# EAGLE design BusBlasterv4 (EAGLE 5.07)
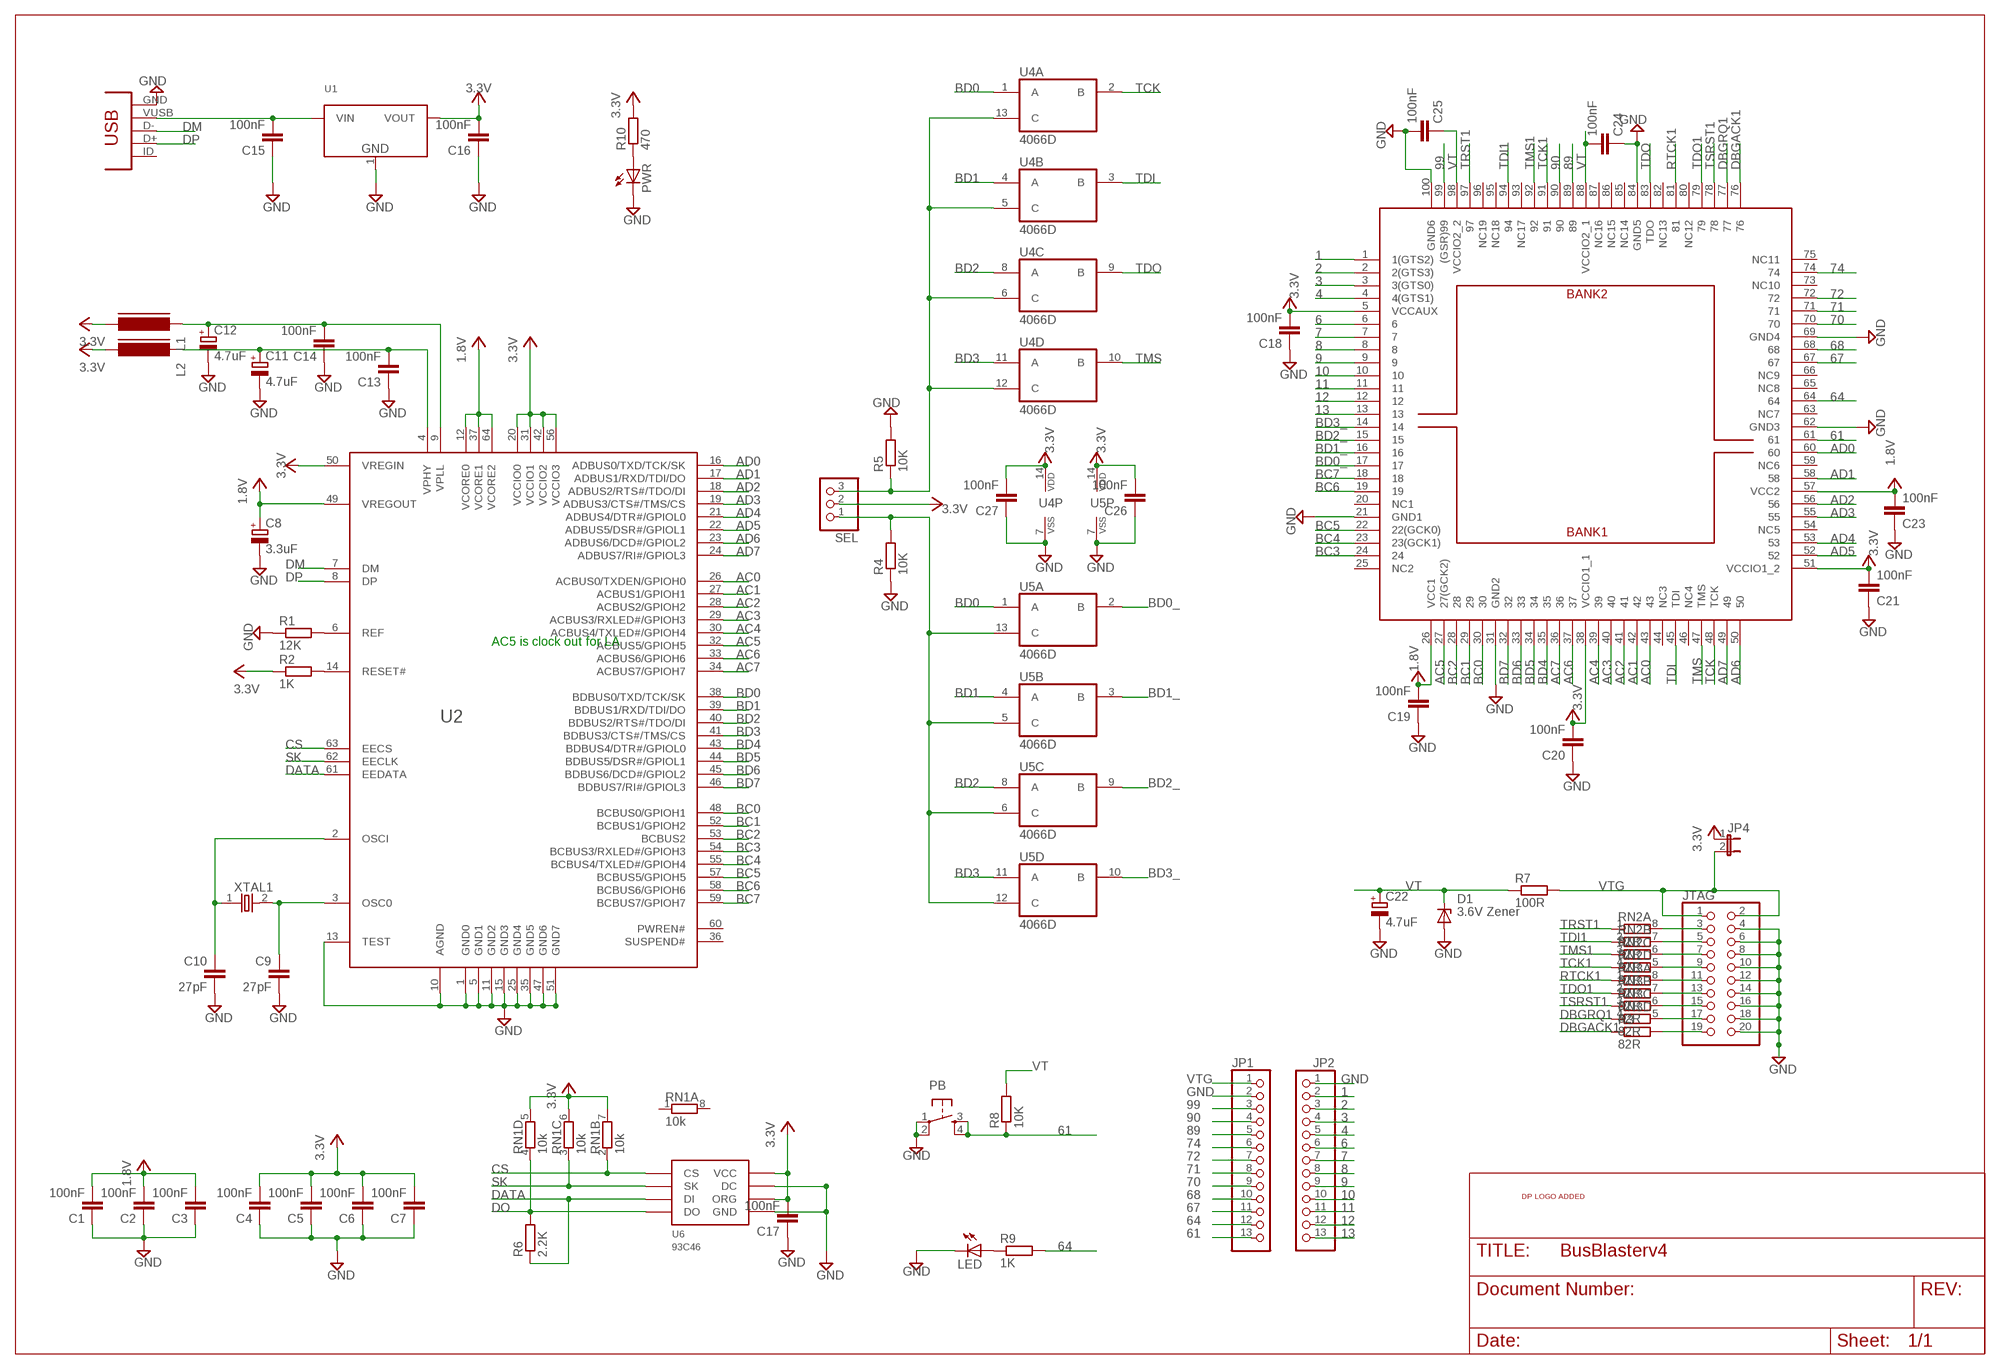
[diagram p0: schematic, sheet 1]

## Parts
C1  100nF  CAPC603  [C603]
C2  100nF  CAPC603  [C603]
C3  100nF  CAPC603  [C603]
C4  100nF  CAPC603  [C603]
C5  100nF  CAPC603  [C603]
C6  100nF  CAPC603  [C603]
C7  100nF  CAPC603  [C603]
C8  3.3uF  CAP_POLSMC_A  [SMC_A]
C9  27pF  CAPC603  [C603]
C10  27pF  CAPC603  [C603]
C11  4.7uF  CAP_POLSMC_A  [SMC_A]
C12  4.7uF  CAP_POLSMC_A  [SMC_A]
C13  100nF  CAPC603  [C603]
C14  100nF  CAPC603  [C603]
C15  100nF  CAPC603  [C603]
C16  100nF  CAPC603  [C603]
C17  100nF  CAPC603  [C603]
C18  100nF  CAPC603  [C603]
C19  100nF  CAPC603  [C603]
C20  100nF  CAPC603  [C603]
C21  100nF  CAPC603  [C603]
C22  4.7uF  CAP_POLSMC_A  [SMC_A]
C23  100nF  CAPC603  [C603]
C24  100nF  CAPC603  [C603]
C25  100nF  CAPC603  [C603]
C26  100nF  CAPC603  [C603]
C27  100nF  CAPC603  [C603]
D1  3.6V Zener  ZENERSOD-123  [SOD-123]
JP1  PINHD-1X13  [1X13]
JP2  PINHD-1X13  [1X13]
JP4  JP1EJP  [1X02]
JTAG  PINHEAD_-_COPY_PINHD-2X10SHROUDED  [PINHEAD_-_COPY_PINSHRD_PTH_2X10]
L1  FERRITE_BEAD603  [FB603]
L2  FERRITE_BEAD603  [FB603]
LED  LED805  [LED-805]
PB  SW-SMD-SMALL  [TACT_SWITCH_SMALL]
PWR  LEDCHIPLED_0805  [CHIPLED_0805]
R1  12K  RESISTORR603  [R603]
R2  1K  RESISTORR603  [R603]
R3  82R  RESISTORR603  [R603]
R4  10K  RESISTORR603  [R603]
R5  10K  RESISTORR603  [R603]
R6  2.2K  RESISTORR603  [R603]
R7  100R  RESISTORR1206  [R1206]
R8  10K  RESISTORR603  [R603]
R9  1K  RESISTORR603  [R603]
R10  470  RESISTORR603  [R603]
RN1  10k  RNETWORK  [RN8P-4R-CRA06S]
RN2  82R  RNETWORK  [RN8P-4R-CRA06S]
RN3  82R  RNETWORK  [RN8P-4R-CRA06S]
SEL  PINHD-1X3  [1X03]
U1  LD1117-3.3SOT223  [SOT223]
U2  FT2232H  [LQFP64]
U3  XC2C64A  [VQ100]
U4  4066D  [SO14]
U5  4066D  [SO14]
U6  93C46  [SOIC8]
U$1  DP_LOGO1.5X1.5  [DP_LOGO_ART_1.5X1.5]
USB  CON-USB-MINI-BUSB1  [CONN_USB_MINI-B]
XTAL1  OSC-XTAL  [HC-49U]

## Nets
1: JP2.2 U3.1(1(GTS2))
1.8V: C1.2 C2.2 C3.2 C8.+ C19.2 C23.2 U2.12(VCORE0) U2.37(VCORE1) U2.49(VREGOUT) U2.64(VCORE2) U3.26(VCC1) U3.57(VCC2)
2: JP2.3 U3.2(2(GTS3))
3: JP2.4 U3.3(3(GTS0))
4: JP2.5 U3.4(4(GTS1))
6: JP2.6 U3.6
7: JP2.7 U3.7
8: JP2.8 U3.8
9: JP2.9 U3.9
10: JP2.10 U3.10
11: JP2.11 U3.11
12: JP2.12 U3.12
13: JP2.13 U3.13
61: JP1.13 PB.3 PB.4 R8.1 U3.61
64: JP1.12 R9.2 U3.64
67: JP1.11 U3.67
68: JP1.10 U3.68
70: JP1.9 U3.70
71: JP1.8 U3.71
72: JP1.7 U3.72
74: JP1.6 U3.74
89: JP1.5 U3.89
90: JP1.4 U3.90
99: JP1.3 U3.99((GSR)99)
+3V3: C4.2 C5.2 C6.2 C7.2 C16.2 C17.2 C18.2 C20.2 C21.2 C26.2 C27.2 JP4.1 L1.2 L2.2 R2.1 R10.2 RN1.5 RN1.6 RN1.7 SEL.2 U1.2(VOUT) U2.20(VCCIO0) U2.31(VCCIO1) U2.42(VCCIO2) U2.50(VREGIN) U2.56(VCCIO3) U3.5(VCCAUX) U3.38(VCCIO1_1) U3.51(VCCIO1_2) U4.14(P:VDD) U5.14(P:VDD) U6.6(ORG) U6.8(VCC) ; supply symbol labelled 3.3V
AC0: U2.26(ACBUS0/TXDEN/GPIOH0) U3.43
AC1: U2.27(ACBUS1/GPIOH1) U3.42
AC2: U2.28(ACBUS2/GPIOH2) U3.41
AC3: U2.29(ACBUS3/RXLED#/GPIOH3) U3.40
AC4: U2.30(ACBUS4/TXLED#/GPIOH4) U3.39
AC5: U2.32(ACBUS5/GPIOH5) U3.27(27(GCK2))
AC6: U2.33(ACBUS6/GPIOH6) U3.37
AC7: U2.34(ACBUS7/GPIOH7) U3.36
AD0: U2.16(ADBUS0/TXD/TCK/SK) U3.60
AD1: U2.17(ADBUS1/RXD/TDI/DO) U3.58
AD2: U2.18(ADBUS2/RTS#/TDO/DI) U3.56
AD3: U2.19(ADBUS3/CTS#/TMS/CS) U3.55
AD4: U2.21(ADBUS4/DTR#/GPIOL0) U3.53
AD5: U2.22(ADBUS5/DSR#/GPIOL1) U3.52
AD6: U2.23(ADBUS6/DCD#/GPIOL2) U3.50
AD7: U2.24(ADBUS7/RI#/GPIOL3) U3.49
BC0: U2.48(BCBUS0/GPIOH1) U3.30
BC1: U2.52(BCBUS1/GPIOH2) U3.29
BC2: U2.53(BCBUS2) U3.28
BC3: U2.54(BCBUS3/RXLED#/GPIOH3) U3.24
BC4: U2.55(BCBUS4/TXLED#/GPIOH4) U3.23(23(GCK1))
BC5: U2.57(BCBUS5/GPIOH5) U3.22(22(GCK0))
BC6: U2.58(BCBUS6/GPIOH6) U3.19
BC7: U2.59(BCBUS7/GPIOH7) U3.18
BD0: U2.38(BDBUS0/TXD/TCK/SK) U4.1(A:A) U5.1(A:A)
BD0_: U3.17 U5.2(A:B)
BD1: U2.39(BDBUS1/RXD/TDI/DO) U4.4(B:A) U5.4(B:A)
BD1_: U3.16 U5.3(B:B)
BD2: U2.40(BDBUS2/RTS#/TDO/DI) U4.8(C:A) U5.8(C:A)
BD2_: U3.15 U5.9(C:B)
BD3: U2.41(BDBUS3/CTS#/TMS/CS) U4.11(D:A) U5.11(D:A)
BD3_: U3.14 U5.10(D:B)
BD4: U2.43(BDBUS4/DTR#/GPIOL0) U3.35
BD5: U2.44(BDBUS5/DSR#/GPIOL1) U3.34
BD6: U2.45(BDBUS6/DCD#/GPIOL2) U3.33
BD7: U2.46(BDBUS7/RI#/GPIOL3) U3.32
CS: RN1.2 U2.63(EECS) U6.1(CS)
DATA: R6.1 U2.61(EEDATA) U6.3(DI)
DBGACK1: R3.1 U3.76
DBGRQ1: RN3.4 U3.77
DM: U2.7(DM) USB.D-
DO: R6.2 RN1.4 U6.4(DO)
DP: U2.8(DP) USB.D+
GND: C1.1 C2.1 C3.1 C4.1 C5.1 C6.1 C7.1 C8.- C9.2 C10.2 C11.- C12.- C13.1 C14.1 C15.1 C16.1 C17.1 C18.1 C19.1 C20.1 C21.1 C22.- C23.1 C24.1 C25.2 C26.1 C27.1 D1.A JP1.2 JP2.1 JTAG.4 JTAG.6 JTAG.8 JTAG.10 JTAG.12 JTAG.14 JTAG.16 JTAG.18 JTAG.20 LED.C PB.1 PB.2 PWR.C R1.1 R4.1 R5.2 U1.1(GND) U2.1(GND0) U2.5(GND1) U2.10(AGND) U2.11(GND2) U2.13(TEST) U2.15(GND3) U2.25(GND4) U2.35(GND5) U2.47(GND6) U2.51(GND7) U3.21(GND1) U3.31(GND2) U3.62(GND3) U3.69(GND4) U3.84(GND5) U3.100(GND6) U4.7(P:VSS) U5.7(P:VSS) U6.5(GND) U6.7(DC) USB.GND
N$1: C9.1 U2.3(OSC0) XTAL1.2
N$2: C10.1 U2.2(OSCI) XTAL1.1
N$3: R2.2 U2.14(RESET#)
N$4: R1.2 U2.6(REF)
N$5: C15.2 U1.3(VIN) USB.VUSB
N$6: PWR.A R10.1
N$8: LED.A R9.1
N$12: JTAG.3 RN2.8
N$27: JTAG.5 RN2.7
N$28: JTAG.7 RN2.6
N$32: JTAG.9 RN2.5
N$33: JTAG.11 RN3.8
N$38: JTAG.13 RN3.7
N$45: JTAG.15 RN3.6
N$52: JTAG.17 RN3.5
N$64: JTAG.19 R3.2
N$72: R5.1 SEL.3 U4.5(B:C) U4.6(C:C) U4.12(D:C) U4.13(A:C)
N$73: R4.2 SEL.1 U5.5(B:C) U5.6(C:C) U5.12(D:C) U5.13(A:C)
RTCK1: RN3.1 U3.81
SK: RN1.3 U2.62(EECLK) U6.2(SK)
TCK: U3.48(TCK) U4.2(A:B)
TCK1: RN2.4 U3.91
TDI: U3.45(TDI) U4.3(B:B)
TDI1: RN2.2 U3.94
TDO: U3.83(TDO) U4.9(C:B)
TDO1: RN3.2 U3.79
TMS: U3.47(TMS) U4.10(D:B)
TMS1: RN2.3 U3.92
TRST1: RN2.1 U3.97
TSRST1: RN3.3 U3.78
VPHY: C11.+ C13.2 L2.1 U2.4(VPHY)
VPLL: C12.+ C14.2 L1.1 U2.9(VPLL)
VT: C22.+ C24.2 C25.1 D1.C R7.1 R8.2 U3.88(VCCIO2_1) U3.98(VCCIO2_2)
VTG: JP1.1 JP4.2 JTAG.1 JTAG.2 R7.2
Unconnected: RN1.1 RN1.8 U2.36(SUSPEND#) U2.60(PWREN#) U3.20(NC1) U3.25(NC2) U3.44(NC3) U3.46(NC4) U3.54(NC5) U3.59(NC6) U3.63(NC7) U3.65(NC8) U3.66(NC9) U3.73(NC10) U3.75(NC11) U3.80(NC12) U3.82(NC13) U3.85(NC14) U3.86(NC15) U3.87(NC16) U3.93(NC17) U3.95(NC18) U3.96(NC19) USB.BODY@1(BODY) USB.BODY@2(BODY) USB.BODY@3(BODY) USB.BODY@4(BODY) USB.ID(USBID)

## Notes on the sheet
- AC5 is clock out for LA

## Library data of the parts
C1-C7 C9 C10 C13-C21 C23-C27 = dp_devices:CAP
C8 C11 C12 C22 = DP-EagleLibrary:CAP_POL
D1 = dp_devices:ZENER: Zener Diode SOD-323
JP1 JP2 = pinhead:PINHD-1X13: PIN HEADER
JP4 = jumper:JP1E: JUMPER
JTAG = LPC1768board:PINHEAD_-_COPY_PINHD-2X10: PIN HEADER
L1 L2 = dp_devices:FERRITE_BEAD
LED = dp_devices:LED
PB = dp_devices:SW-SMD-SMALL
PWR = led:LED: LED OSRAM: - CHIPLED LG R971, LG N971, LY N971, LG Q971, LY Q971, LO R971, LY R971 LH N974, LH R974 LS Q976, LO Q976, LY Q976 LO Q996 - Hyper CHIPLED LW Q18S LB Q993, LB Q99A, LB R99A - SideLED LS A670, LO A670, LY A670, LG A670, LP A670 LB A673, LV A673, LT A673, LW A673 LH A674 LY A675 LS A676, LA A676, LO A676, LY A676, LW A676 LS A679, LY A679, LG A679 - Hyper Micro SIDELED® LS Y876, LA Y876, LO Y876, LY Y876 LT Y87S - SmartLED LW L88C, LW L88S LB L89C, LB L89S, LG L890 LS L89K, LO L89K, LY L89K LS L896, LA L896, LO L896, LY L896 - TOPLED LS T670, LO T670, LY T670, LG T670, LP T670 LSG T670, LSP T670, LSY T670, LOP T670, LYG T670 LG T671, LOG T671, LSG T671 LB T673, LV T673, LT T673, LW T673 LH T674 LS T676, LA T676, LO T676, LY T676, LB T676, LH T676, LSB T676, LW T676 LB T67C, LV T67C, LT T67C, LS T67K, LO T67K, LY T67K, LW E67C LS E67B, LA E67B, LO E67B, LY E67B, LB E67C, LV E67C, LT E67C LW T67C LS T679, LY T679, LG T679 LS T770, LO T770, LY T770, LG T770, LP T770 LB T773, LV T773, LT T773, LW T773 LH T774 LS E675, LA E675, LY E675, LS T675 LS T776, LA T776, LO T776, LY T776, LB T776 LHGB T686 LT T68C, LB T68C - Hyper Mini TOPLED® LB M676 - Mini TOPLED Santana® LG M470 LS M47K, LO M47K, LY M47K Source: http://www.osram.convergy.de LUXEON: - LUMILED® LXK2-PW12-R00, LXK2-PW12-S00, LXK2-PW14-U00, LXK2-PW14-V00 LXK2-PM12-R00, LXK2-PM12-S00, LXK2-PM14-U00 LXK2-PE12-Q00, LXK2-PE12-R00, LXK2-PE12-S00, LXK2-PE14-T00, LXK2-PE14-U00 LXK2-PB12-K00, LXK2-PB12-L00, LXK2-PB12-M00, LXK2-PB14-N00, LXK2-PB14-P00, LXK2-PB14-Q00 LXK2-PR12-L00, LXK2-PR12-M00, LXK2-PR14-Q00, LXK2-PR14-R00 LXK2-PD12-Q00, LXK2-PD12-R00, LXK2-PD12-S00 LXK2-PH12-R00, LXK2-PH12-S00 LXK2-PL12-P00, LXK2-PL12-Q00, LXK2-PL12-R00 Source: www.luxeon.com KINGBRIGHT: KA-3528ASYC Source: www.kingbright.com
R1-R10 = dp_devices:RESISTOR
RN1-RN3 = dp_devices:RNETWORK: 4 Resistor Array 0603
SEL = pinhead:PINHD-1X3: PIN HEADER
U1 = dp_devices:LD1117-3.3
U2 = dp_devices:FT2232H: DUAL HIGH SPEED USB TO MULTIPURPOSE UART/FIFO IC
U3 = fpga:XC2C64A
U4 U5 = 40xx:4066: Quad bilateral ANALOG SWITCH
U6 = DP-EagleLibrary:93C46
U$1 = dp_devices:DP_LOGO
USB = dp_devices:CON-USB-MINI-B: USB connector
XTAL1 = dp_devices:OSC-XTAL

## Board
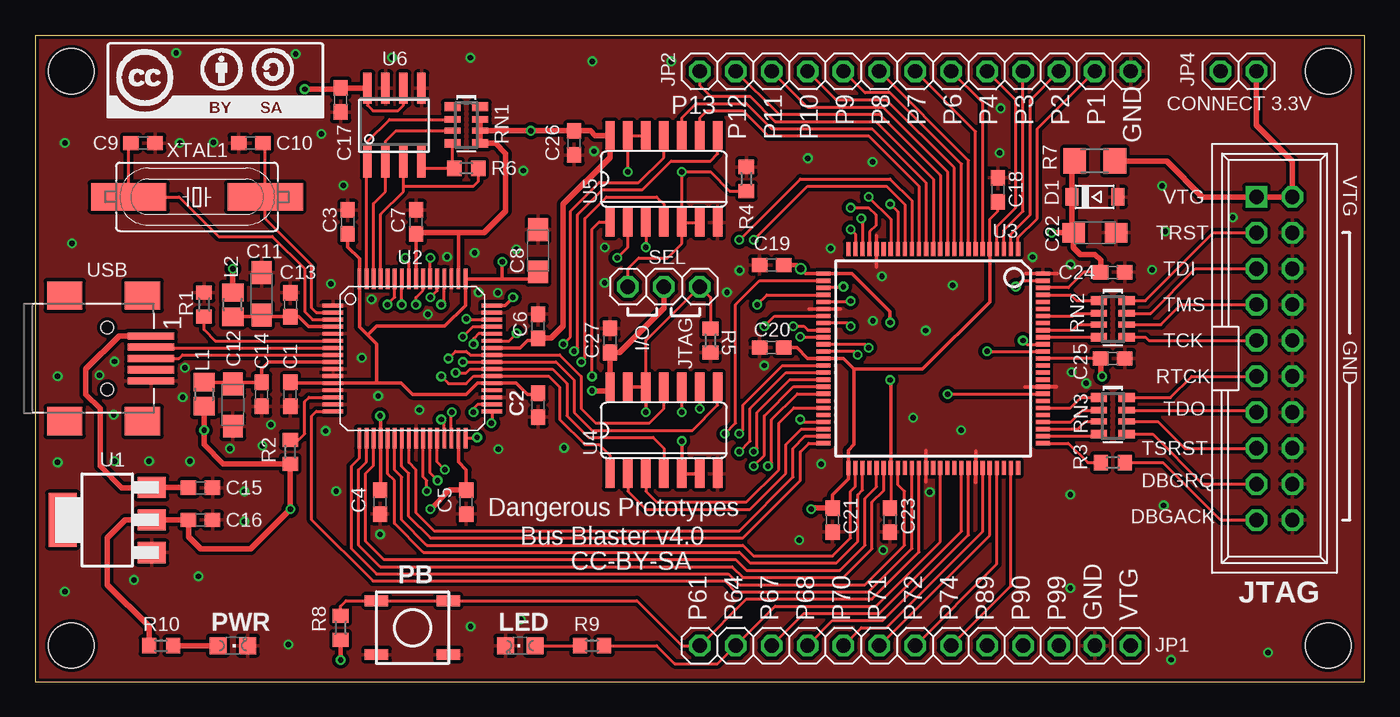
[diagram p1: board, top side]
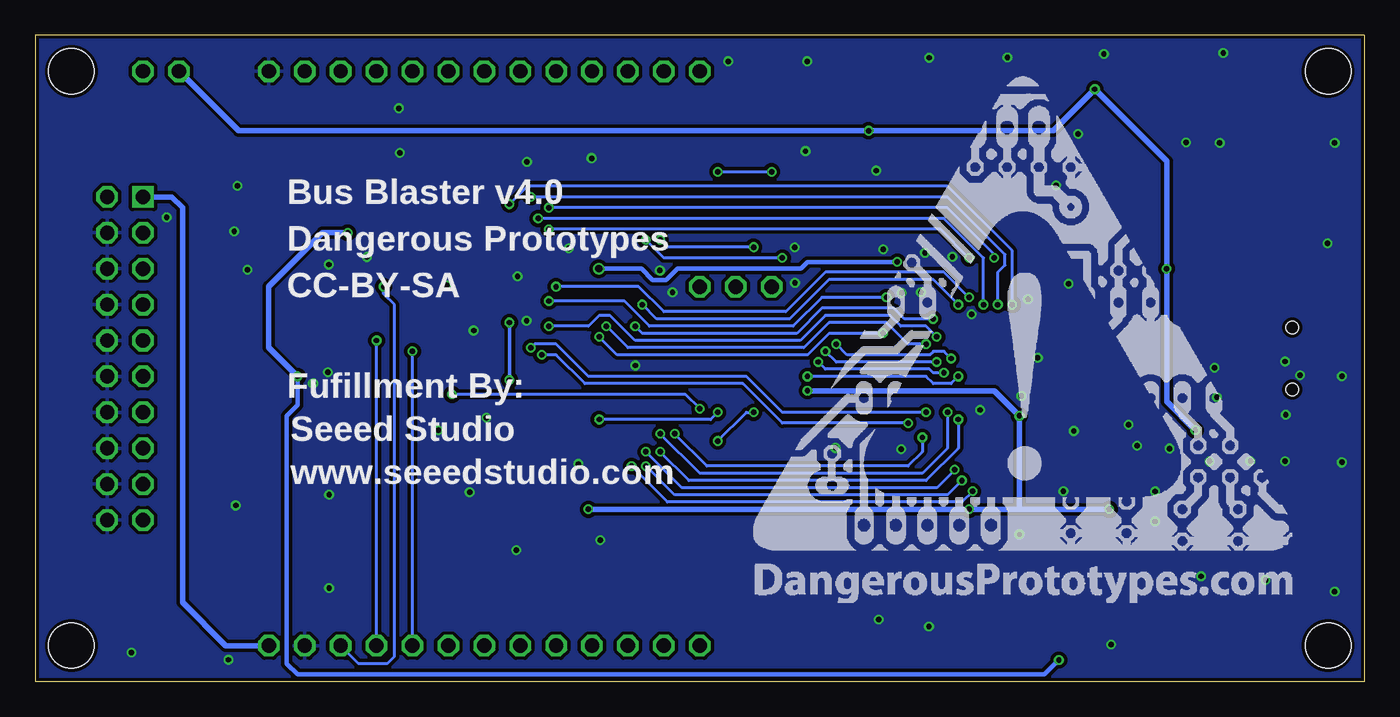
[diagram p2: board, bottom side, seen from below]

Size 93.98 x 45.72 mm. Coordinates in mm from the lower left corner, seen from the top.
Outline: 0,0 93.98,0 93.98,45.72 0,45.72 0,0
Copper layers (1*16): Top 0.035mm / dielectric 1.5mm / Bottom 0.035mm
Design rules "Fusion_eagle_rule_v1.1": minimum track width 6mil, minimum drill 12mil, track to track 6mil, track to pad 6mil, pad to pad 6mil, via to via 6mil, smd to smd 0mil, copper to edge 10mil, drill to drill 10mil, minimum pad ring 10mil, minimum via ring 6mil, stop-mask expansion 2mil, vias tented up to drill 100mil, thermal gap 10mil
Holes 3.2 mm at 2.54,2.54 91.44,2.54 2.54,43.18 91.44,43.18

### Footprints (pad centres in the part's own frame; a part is rotated, then mirrored left to right if it is on the bottom)
C603 = smd 1.1 x 1: 1 -0.85,0; 2 0.85,0
SMC_A = smd 1.6 x 1.4: + -1.5,0; - 1.5,0
SOD-123 = smd 0.91 x 1.22: A 1.635,0; C -1.635,0
1X13 = drill 1.016 octagon: 1 -15.24,0; 2 -12.7,0; 3 -10.16,0; 4 -7.62,0; 5 -5.08,0; 6 -2.54,0; 7 0,0; 8 2.54,0; 9 5.08,0; 10 7.62,0; 11 10.16,0; 12 12.7,0; 13 15.24,0
1X02 = drill 1.016 octagon: 1 -1.27,0; 2 1.27,0
PINHEAD_-_COPY_PINSHRD_PTH_2X10 = drill 1.016 square: 1 -11.43,-1.27 | drill 1.016 octagon: 2 -11.43,1.27; 3 -8.89,-1.27; 4 -8.89,1.27; 5 -6.35,-1.27; 6 -6.35,1.27; 7 -3.81,-1.27; 8 -3.81,1.27; 9 -1.27,-1.27; 10 -1.27,1.27; 11 1.27,-1.27; 12 1.27,1.27; 13 3.81,-1.27; 14 3.81,1.27; 15 6.35,-1.27; 16 6.35,1.27; 17 8.89,-1.27; 18 8.89,1.27; 19 11.43,-1.27; 20 11.43,1.27
FB603 = smd 1.3 x 1.5: 1 -0.85,0; 2 0.85,0
LED-805 = smd 1.2 x 1.2: A 0,-1.05; C 0,1.05
TACT_SWITCH_SMALL = smd 1.651 x 0.762: 1 -2.54,1.905; 2 2.54,1.905; 3 -2.54,-1.905; 4 2.54,-1.905
CHIPLED_0805 = smd 1.2 x 1.2: A 0,-1.05; C 0,1.05
R603 = smd 1 x 1.1: 1 -0.85,0; 2 0.85,0
R1206 = smd 1.6 x 1.803: 1 -1.422,0; 2 1.422,0
RN8P-4R-CRA06S = smd 0.63 x 1.15: 1 -1.295,-0.975; 4 1.295,-0.975; 5 1.295,0.975; 8 -1.295,0.975 | smd 0.44 x 1.15: 2 -0.4,-0.975; 3 0.4,-0.975; 6 0.4,0.975; 7 -0.4,0.975
1X03 = drill 1.016 octagon: 1 -2.54,0; 2 0,0; 3 2.54,0
SOT223 = smd 1.5 x 2: 1 -2.3,-3.15; 2 0,-3.15; 3 2.3,-3.15 | smd 3.8 x 2: 4 0,3.15
LQFP64 = smd 1.45 x 0.27: 1 -5.625,3.75; 2 -5.625,3.25; 3 -5.625,2.75; 4 -5.625,2.25; 5 -5.625,1.75; 6 -5.625,1.25; 7 -5.625,0.75; 8 -5.625,0.25; 9 -5.625,-0.25; 10 -5.625,-0.75; 11 -5.625,-1.25; 12 -5.625,-1.75; 13 -5.625,-2.25; 14 -5.625,-2.75; 15 -5.625,-3.25; 16 -5.625,-3.75; 33 5.625,-3.75; 34 5.625,-3.25; 35 5.625,-2.75; 36 5.625,-2.25; 37 5.625,-1.75; 38 5.625,-1.25; 39 5.625,-0.75; 40 5.625,-0.25; 41 5.625,0.25; 42 5.625,0.75; 43 5.625,1.25; 44 5.625,1.75; 45 5.625,2.25; 46 5.625,2.75; 47 5.625,3.25; 48 5.625,3.75 | smd 0.27 x 1.45: 17 -3.75,-5.625; 18 -3.25,-5.625; 19 -2.75,-5.625; 20 -2.25,-5.625; 21 -1.75,-5.625; 22 -1.25,-5.625; 23 -0.75,-5.625; 24 -0.25,-5.625; 25 0.25,-5.625; 26 0.75,-5.625; 27 1.25,-5.625; 28 1.75,-5.625; 29 2.25,-5.625; 30 2.75,-5.625; 31 3.25,-5.625; 32 3.75,-5.625; 49 3.75,5.625; 50 3.25,5.625; 51 2.75,5.625; 52 2.25,5.625; 53 1.75,5.625; 54 1.25,5.625; 55 0.75,5.625; 56 0.25,5.625; 57 -0.25,5.625; 58 -0.75,5.625; 59 -1.25,5.625; 60 -1.75,5.625; 61 -2.25,5.625; 62 -2.75,5.625; 63 -3.25,5.625; 64 -3.75,5.625
VQ100 = smd 1 x 0.3: 1 -7.75,6; 2 -7.75,5.5; 3 -7.75,5; 4 -7.75,4.5; 5 -7.75,4; 6 -7.75,3.5; 7 -7.75,3; 8 -7.75,2.5; 9 -7.75,2; 10 -7.75,1.5; 11 -7.75,1; 12 -7.75,0.5; 13 -7.75,0; 14 -7.75,-0.5; 15 -7.75,-1; 16 -7.75,-1.5; 17 -7.75,-2; 18 -7.75,-2.5; 19 -7.75,-3; 20 -7.75,-3.5; 21 -7.75,-4; 22 -7.75,-4.5; 23 -7.75,-5; 24 -7.75,-5.5; 25 -7.75,-6; 51 7.75,-6; 52 7.75,-5.5; 53 7.75,-5; 54 7.75,-4.5; 55 7.75,-4; 56 7.75,-3.5; 57 7.75,-3; 58 7.75,-2.5; 59 7.75,-2; 60 7.75,-1.5; 61 7.75,-1; 62 7.75,-0.5; 63 7.75,0; 64 7.75,0.5; 65 7.75,1; 66 7.75,1.5; 67 7.75,2; 68 7.75,2.5; 69 7.75,3; 70 7.75,3.5; 71 7.75,4; 72 7.75,4.5; 73 7.75,5; 74 7.75,5.5; 75 7.75,6 | smd 0.3 x 1: 26 -6,-7.75; 27 -5.5,-7.75; 28 -5,-7.75; 29 -4.5,-7.75; 30 -4,-7.75; 31 -3.5,-7.75; 32 -3,-7.75; 33 -2.5,-7.75; 34 -2,-7.75; 35 -1.5,-7.75; 36 -1,-7.75; 37 -0.5,-7.75; 38 0,-7.75; 39 0.5,-7.75; 40 1,-7.75; 41 1.5,-7.75; 42 2,-7.75; 43 2.5,-7.75; 44 3,-7.75; 45 3.5,-7.75; 46 4,-7.75; 47 4.5,-7.75; 48 5,-7.75; 49 5.5,-7.75; 50 6,-7.75; 76 6,7.75; 77 5.5,7.75; 78 5,7.75; 79 4.5,7.75; 80 4,7.75; 81 3.5,7.75; 82 3,7.75; 83 2.5,7.75; 84 2,7.75; 85 1.5,7.75; 86 1,7.75; 87 0.5,7.75; 88 0,7.75; 89 -0.5,7.75; 90 -1,7.75; 91 -1.5,7.75; 92 -2,7.75; 93 -2.5,7.75; 94 -3,7.75; 95 -3.5,7.75; 96 -4,7.75; 97 -4.5,7.75; 98 -5,7.75; 99 -5.5,7.75; 100 -6,7.75
SO14 = smd 0.66 x 2.032: 1 -3.81,-3.073; 2 -2.54,-3.073; 3 -1.27,-3.073; 4 0,-3.073; 5 1.27,-3.073; 6 2.54,-3.073; 7 3.81,-3.073; 8 3.81,3.073; 9 2.54,3.073; 10 1.27,3.073; 11 0,3.073; 12 -1.27,3.073; 13 -2.54,3.073; 14 -3.81,3.073
SOIC8 = smd 0.6 x 2.2: 1 -1.905,-2.6; 2 -0.635,-2.6; 3 0.635,-2.6; 4 1.905,-2.6; 5 1.905,2.6; 6 0.635,2.6; 7 -0.635,2.6; 8 -1.905,2.6
CONN_USB_MINI-B = smd 2 x 2.5: BODY@1 -4.45,2.5; BODY@2 4.45,2.5; BODY@3 4.45,-3; BODY@4 -4.45,-3 | smd 0.5 x 3.3: D+ 0,3.1; D- -0.8,3.1; GND 1.6,3.1; ID 0.8,3.1; VUSB -1.6,3.1 | hole 0.9: -2.2,0; 2.2,0
HC-49U = smd 5.334 x 1.93: 1 -4.826,0; 2 4.826,0

### Placement (x,y rotation side)
C1  18.03,20.32 90 top
C2  35.56,19.56 90 top
C3  22.1,32.51 270 top
C4  24.38,12.7 90 top
C5  30.48,12.7 90 top
C6  35.56,25.15 270 top
C7  26.92,32.51 270 top
C8  35.56,30.48 90 top
C9  7.62,38.1 0 top
C10  15.24,38.1 180 top
C11  16,27.43 90 top
C12  13.97,19.56 270 top
C13  18.03,26.67 270 top
C14  16,20.32 90 top
C15  11.68,13.72 180 top
C16  11.68,11.43 180 top
C17  21.59,41.15 90 top
C18  68.07,34.8 270 top
C19  52.07,29.46 0 top
C20  52.07,23.62 0 top
C21  56.39,11.43 90 top
C22  74.93,31.75 0 top
C23  60.45,11.43 90 top
C24  76.2,28.96 180 top
C25  76.2,22.86 0 top
C26  38.1,38.1 90 top
C27  40.64,24.13 270 top
D1  74.93,34.29 0 top
JP1  62.23,2.54 180 top
JP2  62.23,43.18 180 top
JP4  85.09,43.18 0 top
JTAG  87.63,22.86 270 top
L1  11.94,20.32 270 top
L2  13.97,26.67 90 top
LED  34.29,2.54 90 top
PB  26.67,3.81 180 top
PWR  13.97,2.54 270 top
R1  11.94,26.67 270 top
R2  18.03,16.26 90 top
R3  76.2,15.49 0 top
R4  50.29,35.56 270 top
R5  47.75,24.13 270 top
R6  30.48,36.32 180 top
R7  74.93,36.83 0 top
R8  21.59,3.81 270 top
R9  39.37,2.54 0 top
R10  8.89,2.54 180 top
RN1  30.48,39.37 270 top
RN2  76.2,25.65 270 top
RN3  76.2,18.8 270 top
SEL  44.45,27.94 0 top
U1  5.08,11.43 90 top
U2  26.67,22.86 0 top
U3  63.5,22.86 270 top
U4  44.45,17.78 0 top
U5  44.45,35.56 0 top
U6  25.4,39.37 0 top
U$1  43.18,5.59 0 bottom
U$2  [CC-BY-SA]  5.08,39.88 0 top
USB  5.08,22.86 270 top
XTAL1  11.43,34.29 180 top

### Tracks (layer width: path | path; a pad name or v marks a point on that pad's centre or on a via)
1
  Top 0.203: U3.1 69.5,31.4 70.87,32.77 70.87,39.12 JP2.2
1.8V  (via drill 0.38, 0.51)
  Top 0.203: U3.57 60.5,12.49 C23.2
  Top 0.254: C1.2 18.09,21.11 U2.12 24.13,21.11 | 33.02,28.48 U2.49 30.42,26.61 28.96,25.15 24.13,25.15 23.5,24.51 | 33.02,28.48 35.06,28.48 C8.+ | C3.2 22.1,30.73 22.92,29.91 U2.64 22.92,25.09 23.5,24.51 | C2.2 35.39,20.32 34.8,20.32 34.01,21.11 U2.37 31.27,21.11 30.48,20.32 26.67,20.32 25.88,21.11 24.13,21.11 | 23.5,24.51 24.13,23.88 24.13,21.11 | U3.57 60.5,21.29 v60.45,21.34 | v60.45,25.4 60.45,26.16 57.75,28.86 U3.26 54.48,28.86 v54.13,29.21 | 33.02,28.48 v33.02,29.69
  Top 0.305: C19.2 53.88,29.46 v54.13,29.21
  Bottom 0.254: v60.45,25.4 v60.45,21.34
  Bottom 0.305: v54.13,29.21 51.12,29.21 50.32,28.42 49.37,28.42 48.58,29.21 39.85,29.21 39.37,29.69 v33.02,29.69
2
  Top 0.203: U3.2 69,31.66 70.36,33.02 70.36,41.15 JP2.3
3
  Top 0.203: U3.3 68.5,31.92 69.85,33.27 JP2.4
4
  Top 0.203: U3.4 68,32.19 69.34,33.53 69.34,41.15 JP2.5
6
  Top 0.203: U3.6 67,40.95 JP2.6
7
  Top 0.203: U3.7 66.5,38.91 JP2.7
8
  Top 0.203: U3.8 66,36.87 JP2.8
9
  Top 0.203: U3.9 65.5,36.61 60.45,41.66 58.67,41.66 JP2.9
10
  Top 0.203: U3.10 65,36.35 60.2,41.15 56.64,41.15 JP2.10
11
  Top 0.203: JP2.11 54.61,40.64 59.94,40.64 64.5,36.08 U3.11
12
  Top 0.203: JP2.12 52.58,40.13 59.69,40.13 64,35.82 U3.12
13
  Top 0.203: JP2.13 46.99,42.16 47.75,41.4 50.55,41.4 52.32,39.62 59.44,39.62 63.5,35.56 U3.13
61
  Top 0.203: R8.1 21.59,5.33 21.97,5.71 PB.4 PB.3 42.55,5.71 45.72,2.54 JP1.13 50.29,5.84 59.18,5.84 62.5,9.16 U3.61
64
  Top 0.203: U3.64 64,9.9 59.44,5.33 52.32,5.33 JP1.12 48.26,1.27 45.21,1.27 43.94,2.54 R9.2
67
  Top 0.203: U3.67 65.5,10.64 59.69,4.83 54.36,4.83 JP1.11
68
  Top 0.203: U3.68 66,10.37 59.94,4.32 56.39,4.32 JP1.10
70
  Top 0.203: U3.70 67,10.61 60.2,3.81 58.42,3.81 JP1.9
71
  Top 0.203: U3.71 67.5,10.35 JP1.8
72
  Top 0.203: U3.72 68,8.31 JP1.7
74
  Top 0.203: U3.74 69,6.77 JP1.6
89  (via drill 0.38)
  Top 0.203: v67.31,23.37 v67.32,23.36 U3.89
  Bottom 0.203: JP1.5 v67.31,23.37
90  (via drill 0.38)
  Top 0.203: U3.90 70.12,23.86 v69.85,24.13
  Bottom 0.203: JP1.4 v69.85,24.13
99  (via drill 0.38)
  Top 0.203: v69.34,27.94 69.76,28.36 U3.99
  Bottom 0.203: JP1.3 71.12,1.27 69.09,1.27 68.58,1.78 68.58,26.67 69.34,27.43 v69.34,27.94
+3V3  (via drill 0.38)
  Top 0.203: U6.6 26.04,40.77 25.65,40.39 23.88,40.39 23.5,40.77 U6.8 | U3.5 67.5,32.7 68.07,33.27 C18.2
  Top 0.254: U2.42 34.28,23.61 34.8,24.13 35.39,24.13 C6.2 | U2.56 26.92,31.58 C7.2 | C20.2 53.85,23.62 54.61,22.86 U3.38 57.15,22.86 57.91,22.1 | v24.38,18.8 24.42,18.76 U2.20 24.42,13.59 C4.2 | U2.31 29.92,15.55 30.48,14.99 C5.2 | U2.50 29.92,31.7 29.97,31.75 | 57.91,22.1 62.74,22.1 67.5,26.86 U3.5 | 57.91,22.1 57.91,16.76 57.5,16.35 U3.51 57.5,14.32 56.39,13.21 C21.2
  Top 0.381: R10.2 8.04,3.9 5.08,6.86 5.08,10.16 6.35,11.43 U1.2 C16.2 10.83,10.25 11.68,9.4 15.24,9.4 v18.03,12.19 R2.1 13.3,15.41 11.94,16.76 v11.94,17.78 L1.2 | RN1.6 RN1.7 | RN1.6 RN1.5 32.54,38.08 33.27,37.34 33.27,33.27 31.75,31.75 29.97,31.75 27.01,31.75 C7.2 | 38.08,38.97 v35.05,38.97 RN1.6 | 38.08,38.97 C26.2 | SEL.2 44.45,26.42 41.31,23.28 C27.2 U4.14 40.64,20.57 v39.37,20.57 | v13.97,29.21 L2.2 | C5.2 29.3,13.55 v27.94,12.19 | C6.2 36.49,24.3 37.34,25.15 37.34,33.78 40.64,37.08 U5.14 39.6,38.63 39.26,38.97 38.08,38.97 | U6.8 23.47,42 C17.2 21.5,41.91 v19.05,41.91 | C21.2 54.95,12.28 v54.86,12.19
  Bottom 0.381: v11.94,17.78 13.97,19.81 v13.97,29.21 13.97,36.83 v19.05,41.91 21.99,38.97 v35.05,38.97 79.61,38.97 JP4.1 | v18.03,12.19 24.38,12.19 | 24.38,12.19 v27.94,12.19 v54.86,12.19 | 24.38,12.19 v24.38,18.8 26.16,20.57 v39.37,20.57
AC0  (via drill 0.38)
  Top 0.203: U3.43 53.89,20.36 52.07,18.54 52.07,15.49 v51.82,15.24 | v27.69,13.46 27.69,14.22 27.42,14.49 U2.26
  Bottom 0.203: v51.82,15.24 49.28,12.7 28.45,12.7 v27.69,13.46
AC1  (via drill 0.38)
  Top 0.203: U3.42 53.63,20.86 51.56,18.8 51.56,16 v50.8,15.24 | U2.27 27.92,14.75 v28.45,14.22
  Bottom 0.203: v50.8,15.24 48.77,13.21 29.46,13.21 v28.45,14.22
AC2  (via drill 0.38)
  Top 0.203: U3.41 53.36,21.36 51.05,19.05 51.05,16.51 v50.8,16.26 | U2.28 28.42,15.52 v28.96,14.99
  Bottom 0.203: v28.96,14.99 30.23,13.72 48.26,13.72 v50.8,16.26
AC3  (via drill 0.38)
  Top 0.203: U2.29 28.92,18.32 v28.7,18.54 | v49.78,16.26 50.55,17.02 50.55,19.3 53.1,21.86 U3.40
  Bottom 0.203: v28.7,18.54 28.7,16.51 30.99,14.22 47.75,14.22 v49.78,16.26
AC4  (via drill 0.38)
  Top 0.203: U3.39 52.84,22.36 50.04,19.56 50.04,17.78 v49.78,17.53 | U2.30 29.42,19.09 v29.46,19.05
  Bottom 0.203: v49.78,17.53 46.99,14.73 31.24,14.73 29.46,16.51 v29.46,19.05
AC5  (via drill 0.38)
  Top 0.203: U2.32 31.2,17.23 v31.24,17.27 | v48.77,17.53 49.53,18.29 49.53,26.67 51.22,28.36 U3.27
  Bottom 0.203: v31.24,17.27 31.24,16.26 32.26,15.24 46.48,15.24 v48.77,17.53
AC6  (via drill 0.38)
  Top 0.203: U2.33 32.3,18.32 v32.26,18.29 | v58.17,23.11 57.9,23.36 U3.37
  Bottom 0.203: v32.26,18.29 41.15,18.29 43.94,21.08 55.12,21.08 57.15,23.11 v58.17,23.11
AC7  (via drill 0.38)
  Top 0.203: U2.34 31.29,19.61 30.99,19.3 v30.99,19.05 | v58.93,23.62 58.69,23.86 U3.36
  Bottom 0.203: v30.99,19.05 41.15,19.05 43.69,21.59 54.86,21.59 57.15,23.88 58.67,23.88 v58.93,23.62
AD0
  Top 0.203: U2.16 19.87,19.11 19.56,18.8 19.56,11.43 23.88,7.11 48.77,7.11 49.53,6.35 58.93,6.35 62,9.42 U3.60
AD1
  Top 0.203: U3.58 61,13.93 61.47,13.46 61.47,9.65 58.67,6.86 49.78,6.86 49.02,7.62 24.13,7.62 22.35,9.4 22.35,15.24 22.92,15.81 U2.17
AD2
  Top 0.203: U3.56 60,13.52 59.18,12.7 59.18,9.4 57.15,7.37 50.04,7.37 49.28,8.13 24.38,8.13 22.86,9.65 22.86,14.99 23.42,15.55 U2.18
AD3
  Top 0.203: U2.19 23.92,15.28 23.37,14.73 23.37,9.91 24.64,8.64 49.53,8.64 50.29,7.87 56.9,7.87 58.67,9.65 58.67,12.95 59.5,13.78 U3.55
AD4
  Top 0.203: U2.21 24.92,14.7 25.4,14.22 25.4,11.18 27.43,9.14 49.78,9.14 50.55,8.38 56.64,8.38 58.17,9.91 58.17,13.21 58.5,13.54 U3.53
AD5
  Top 0.203: U2.22 25.42,14.97 25.91,14.48 25.91,11.43 27.69,9.65 50.04,9.65 50.8,8.89 56.39,8.89 57.66,10.16 57.66,13.46 58,13.8 U3.52
AD6
  Top 0.203: U2.23 25.92,15.23 26.42,14.73 26.42,11.68 27.94,10.16 50.04,10.16 54.1,14.22 54.1,16.26 54.71,16.86 U3.50
AD7
  Top 0.203: U2.24 26.42,15.49 26.92,14.99 26.92,11.94 28.19,10.67 49.78,10.67 53.59,14.48 53.59,16.51 54.44,17.36 U3.49
BC0  (via drill 0.38)
  Top 0.203: v57.66,26.92 57.59,26.86 U3.30
  Top 0.254: U2.48 33.21,26.61 v33.78,27.18
  Bottom 0.203: v33.78,27.18 38.35,27.18 40.39,25.15 50.55,25.15 52.32,26.92 v57.66,26.92
BC1  (via drill 0.38)
  Top 0.203: U3.29 51.74,27.36 v51.05,26.67 | v28.7,26.67 28.92,26.89 U2.52
  Bottom 0.203: v51.05,26.67 50.04,25.65 40.64,25.65 37.85,28.45 30.48,28.45 v28.7,26.67
BC2  (via drill 0.38)
  Top 0.203: U3.28 57.07,27.86 v57.15,27.94 | v27.94,27.18 28.42,27.66 U2.53
  Bottom 0.203: v57.15,27.94 51.31,27.94 49.53,26.16 40.89,26.16 38.1,28.96 29.72,28.96 v27.94,27.18
BC3  (via drill 0.38)
  Top 0.203: U2.54 27.92,29.95 v27.94,29.97 | v57.66,32 58,31.66 U3.24
  Bottom 0.203: v27.94,29.97 29.97,32 v57.66,32
BC4  (via drill 0.38)
  Top 0.203: U2.55 27.42,27.67 26.92,27.18 v26.92,26.67 | v58.42,32.77 58.5,32.69 U3.23
  Bottom 0.203: v26.92,26.67 26.92,29.97 29.72,32.77 v58.42,32.77
BC5  (via drill 0.38)
  Top 0.203: U2.57 26.42,29.71 v26.16,29.97 | v57.66,33.53 58.93,33.53 59.44,33.02 59.44,32.26 59,31.82 U3.22
  Bottom 0.203: v26.16,29.97 26.16,30.23 29.46,33.53 v57.66,33.53
BC6  (via drill 0.38)
  Top 0.203: U2.58 25.92,26.68 v25.91,26.67 | v58.93,34.29 60.5,32.72 U3.19
  Bottom 0.203: v25.91,26.67 25.91,28.96 25.4,29.46 25.4,30.23 29.46,34.29 v58.93,34.29
BC7  (via drill 0.38)
  Top 0.203: U2.59 25.42,27.2 v24.89,26.67 | v60.45,33.78 61,33.23 U3.18
  Bottom 0.203: v24.89,26.67 24.89,30.48 29.46,35.05 59.18,35.05 v60.45,33.78
BD0  (via drill 0.38)
  Top 0.203: v28.7,21.59 29.21,21.08 30.48,21.08 31.01,21.61 U2.38 36.3,21.61 37.08,20.83 37.08,18.54 38.86,16.76 39.88,16.76 40.64,16 U4.1 | U5.1 40.62,32.51 39.88,32.51 39.37,32 v39.37,21.59
  Bottom 0.203: v28.7,21.59 29.21,21.08 30.48,21.08 30.99,21.59 v39.37,21.59
BD0_  (via drill 0.38)
  Top 0.203: U5.2 41.91,30.73 v41.15,29.97 | v50.8,31.24 54.61,35.05 60.2,35.05 61.5,33.75 U3.17
  Bottom 0.203: v41.15,29.97 49.53,29.97 v50.8,31.24
BD1  (via drill 0.38)
  Top 0.203: U5.4 44.45,33.78 43.94,34.29 40.39,34.29 38.86,32.77 38.86,22.86 v38.61,22.61 | U4.4 44.45,16.51 43.69,17.27 39.12,17.27 37.59,18.8 37.59,21.08 36.56,22.11 U2.39 30.75,22.11 30.48,21.84 v29.72,21.84
  Bottom 0.203: v38.61,22.61 38.1,22.1 30.73,22.1 30.48,21.84 v29.72,21.84
BD1_  (via drill 0.38)
  Top 0.203: U5.3 v43.18,30.73 | v49.78,31.24 54.1,35.56 60.45,35.56 62,34.01 U3.16
  Bottom 0.203: v43.18,30.73 49.28,30.73 v49.78,31.24
BD2  (via drill 0.38)
  Top 0.203: U4.8 48.26,19.56 46.48,17.78 39.37,17.78 38.1,19.05 38.1,21.34 36.83,22.61 U2.40 v30.22,22.61 v30.23,22.61 | U5.8 48.26,37.34 47.75,36.83 44.96,36.83 42.93,34.8 40.13,34.8 38.35,33.02 38.35,23.62 v38.1,23.37
  Bottom 0.203: v38.1,23.37 37.34,22.61 v30.23,22.61
BD2_
  Top 0.203: U3.15 62.5,35.04 58.93,38.61 51.82,38.61 50.04,40.39 47.5,40.39 46.99,39.88 U5.9
BD3  (via drill 0.38)
  Top 0.203: U4.11 44.45,19.3 43.43,18.29 39.62,18.29 38.61,19.3 38.61,21.59 37.09,23.11 U2.41 30.74,23.11 30.48,23.37 29.72,23.37 v29.21,22.86 | U5.11 44.45,37.08 42.67,35.31 39.88,35.31 37.85,33.27 37.85,24.38 v37.34,23.88
  Bottom 0.203: v37.34,23.88 36.58,23.11 30.73,23.11 30.48,23.37 29.72,23.37 v29.21,22.86
BD3_
  Top 0.203: U3.14 63,35.3 59.18,39.12 52.07,39.12 50.29,40.89 46.74,40.89 45.72,39.88 U5.10
BD4  (via drill 0.38)
  Top 0.203: U2.43 33.51,24.11 v34.04,24.64 | v54.1,24.38 54.13,24.36 U3.35
  Bottom 0.203: v54.1,24.38 52.83,23.11 39.37,23.11 37.85,24.64 v34.04,24.64
BD5  (via drill 0.38)
  Top 0.203: U2.44 31.35,24.61 31.02,24.28 31.02,23.91 v30.99,23.88 | v53.59,25.15 54.36,25.15 54.64,24.86 U3.34
  Bottom 0.203: v30.99,23.88 32.26,23.88 33.78,25.4 37.85,25.4 39.62,23.62 52.07,23.62 v53.59,25.15
BD6  (via drill 0.38)
  Top 0.203: v57.66,25.15 57.44,25.36 U3.33 | U2.45 30.95,25.11 v30.23,24.38
  Bottom 0.203: v57.66,25.15 54.86,25.15 54.1,25.91 53.34,25.91 51.56,24.13 39.88,24.13 38.1,25.91 33.53,25.91 32.77,25.15 30.99,25.15 v30.23,24.38
BD7  (via drill 0.38)
  Top 0.203: U2.46 30.44,25.61 v30.48,25.65 | v51.56,25.15 52.28,25.86 U3.32
  Bottom 0.203: v30.48,25.65 32.51,25.65 33.27,26.42 38.35,26.42 40.13,24.64 51.05,24.64 v51.56,25.15
CS
  Top 0.203: U2.63 23.42,36.7 U6.1 23.5,38.23 25.04,39.77 RN1.2
DATA
  Top 0.203: U2.61 24.42,33.06 26.04,34.67 26.04,35.05 | 26.04,35.05 U6.3 | R6.1 31.33,35.39 30.99,35.05 26.04,35.05
DBGACK1
  Top 0.203: U3.76 73.06,16.86 74.42,15.49 R3.1
DBGRQ1
  Top 0.203: U3.77 75.08,17.36 RN3.4
DM
  Top 0.203: U2.7 8.23,23.61 USB.D-
DO
  Top 0.203: RN1.4 29.5,36.45 R6.2 27.18,36.32 27.3,36.45 U6.4
DP
  Top 0.203: U2.8 10.41,23.11 10.16,22.86 USB.D+
GND  (via drill 0.38)
  Top 0.254: 69.98,20.85 72.21,20.85 | 72.21,20.85 72.22,20.85 | U3.84 72.2,20.86 72.21,20.85 | 63,16.36 63,14.13 63,14.14 U3.62 | 66.5,16.32 66.5,14.09 66.5,14.1 U3.69 | 56.95,26.37 54.72,26.37 54.73,26.36 U3.31 | 59.49,29.31 59.49,31.54 59.5,31.53 U3.21 | 70.04,28.85 72.27,28.85
  other vias: 59.97,9.29 24.38,10.41 54.02,10 30.79,3.89 34.33,4.38 17.89,2.62 14.78,11.33 14.78,13.45 10.93,15.58 5.6,15.6 16.66,18.17 16.06,16.68 13.76,16.49 5.6,22.64 5.55,18.88 10.42,20.11 10.59,22.19 10.21,38.12 12.6,38.16 25.23,44.16 30.76,44.14 18.41,44.39 20.24,38.75 21.79,35.1 20.91,28.13 23.08,22.92 24.24,20.2 20.53,17.73 21.27,13.47 27.16,19.22 32.75,16.44 37.4,16.54 32.71,27.5 31.35,27.53 40.26,28.2 40.28,30.72 34.52,36.15 39.51,37.53 34.02,30.57 31.06,30.32 48.91,27.53 49.81,29.08 56.25,30.66 68.21,37.41 68.27,40.56 79.69,35.07 79.92,31.85 78.99,29.14 84.69,32.84 70.53,30.03 73.22,29.5 59.88,28.66 64.89,28.04 62.98,24.83 74.33,21.09 73.3,21.89 62.09,18.66 65.48,17.79 55.58,15.39 59.24,25.53 51.56,22.36 29.12,30.05 23.78,27.04 27.77,25.99 39.4,43.88 44.98,43.88 59.21,36.77 54.64,37.02 2.08,38.12 9.96,44.47 87.17,2.05 79.81,12.46 80.32,1.54 73.2,13.22 73.2,6.62 1.58,15.51 1.58,21.61 2.59,31 2.08,6.37 6.97,7.19 11.54,7.44 63.26,13.39 8.05,15.59 4.53,21.67
  pour Bottom (isolate 0.254): 0,0 93.98,0 93.98,45.72 0,45.72
  pour Top (isolate 0.254): 0,0 93.98,0 93.98,45.72 0,45.72
N$1
  Top 0.203: U2.3 19.6,25.61 19.05,26.16 19.05,29.21 16.76,31.5 12.95,31.5 10.16,34.29 XTAL1.2 6.6,37.93 C9.1
N$2
  Top 0.203: U2.2 19.86,26.11 19.56,26.42 19.56,29.46 16.26,32.77 XTAL1.1 16.26,37.93 C10.1
N$3
  Top 0.203: U2.14 19.35,20.11 19.05,19.81 19.05,17.53 18.63,17.11 R2.2
N$4
  Top 0.203: U2.6 12.72,24.11 11.94,24.89 R1.2
N$5
  Top 0.381: USB.VUSB 5.92,24.46 3.56,22.1 3.56,20.32 4.57,19.3 4.57,15.24 6.1,13.72 8.22,13.72 U1.3 C15.2
N$6
  Top 0.381: R10.1 PWR.A
N$8
  Top 0.203: LED.A R9.1
N$12
  Top 0.203: RN2.8 78.51,26.95 83.31,31.75 JTAG.3
N$27
  Top 0.203: RN2.7 78.89,26.05 82.04,29.21 JTAG.5
N$28
  Top 0.203: RN2.6 79.61,25.25 81.03,26.67 JTAG.7
N$32
  Top 0.203: RN2.5 78.51,24.36 78.74,24.13 JTAG.9
N$33
  Top 0.203: RN3.8 80.29,20.09 81.79,21.59 JTAG.11
N$38
  Top 0.203: RN3.7 86.21,19.2 JTAG.13
N$45
  Top 0.203: RN3.6 79.39,18.4 81.28,16.51 JTAG.15
N$52
  Top 0.203: RN3.5 79.02,17.5 82.55,13.97 JTAG.17
N$64
  Top 0.203: R3.2 79.76,15.49 83.82,11.43 JTAG.19
N$72  (via drill 0.38)
  Top 0.203: R5.1 47.75,27.18 SEL.3 43.18,24.13 U4.12
  Top 0.254: U4.13 U4.12 v43.18,19.05 | U4.6 U4.5 v45.72,17.02
  Bottom 0.203: v43.18,19.05 43.69,19.05 v45.72,17.02
N$73  (via drill 0.38)
  Top 0.203: U5.12 U5.13 v41.91,36.07 | U5.5 U5.6 | U5.5 45.72,30.99 44.7,29.97 42.67,29.97 41.91,29.21 SEL.1 | U5.5 v45.72,36.07 47.75,36.07 49.11,34.71 R4.2
  Bottom 0.203: v45.72,36.07 v41.91,36.07
RTCK1
  Top 0.203: U3.81 73.21,19.36 73.94,20.09 RN3.1
SK
  Top 0.203: RN1.3 25.51,38.97 24.77,38.23 U6.2 24.77,34.67 23.92,33.83 U2.62
TCK
  Top 0.203: U3.48 54.18,17.86 53.09,16.76 53.09,14.73 50.55,12.19 43.18,12.19 41.91,13.46 U4.2
TCK1
  Top 0.203: U3.91 74.91,24.36 75.16,24.36 RN2.4
TDI
  Top 0.203: U3.45 53.65,19.36 52.58,18.29 52.58,14.99 50.29,12.7 43.94,12.7 43.18,13.46 U4.3
TDI1
  Top 0.203: U3.94 73.36,25.86 73.55,26.05 RN2.2
TDO  (via drill 0.38)
  Top 0.203: U3.83 64.56,20.36 v64.52,20.32 | v46.99,19.3 U4.9
  Bottom 0.203: v64.52,20.32 48.01,20.32 v46.99,19.3
TDO1
  Top 0.203: U3.79 73.22,18.36 74.06,19.2 RN3.2
TMS  (via drill 0.38)
  Top 0.203: U3.47 54.28,18.36 v54.1,18.54 | v45.72,19.05 U4.10
  Bottom 0.203: v54.1,18.54 46.23,18.54 v45.72,19.05
TMS1
  Top 0.203: U3.92 73.37,24.86 73.77,25.25 RN2.3
TRST1
  Top 0.203: U3.97 73.22,27.36 73.41,27.18 73.64,26.95 RN2.1
TSRST1
  Top 0.203: U3.78 73.74,17.86 74.28,18.4 RN3.3
VPHY
  Top 0.254: U2.4 19.34,25.11 18.63,25.82 C13.2 16.11,25.82 C11.+ 15.89,25.82 L2.1
VPLL
  Top 0.254: U2.9 16.51,22.61 16,22.1 C14.2 14.08,21.17 C12.+ 13.86,21.17 L1.1
VT  (via drill 0.38)
  Top 0.203: C24.2 74.17,28.96 73.07,27.86 U3.98 | C25.1 U3.88
  Top 0.305: v21.59,1.52 R8.2
  Top 0.381: R7.1 73.3,36.62 D1.C 73.3,31.89 C22.+ | C22.+ 73.43,30.71 73.91,30.23 74.93,30.23 75.35,29.81 C24.2 | v71.88,31.75 C22.+ | C25.1 75.35,21.68 v75.44,21.59
  Bottom 0.305: v21.59,1.52 22.61,0.51 75.44,0.51 76.2,1.27 76.2,18.8 75.44,19.56 v75.44,21.59
  Bottom 0.381: v71.88,31.75 73.66,31.75 77.47,27.94 77.47,23.62 v75.44,21.59
VTG
  Top 0.381: 76.2,36.98 R7.2 80.01,36.83 82.55,34.29 JTAG.1 JTAG.2 88.9,36.83 86.36,39.37 JP4.2
  Bottom 0.381: JP1.1 80.52,2.54 83.57,5.59 83.57,33.53 84.33,34.29 JTAG.1

### Text on the board
tNames: P13 | CONNECT 3.3V | P9 | P8 | P7 | P6 | P4 | P3 | P2 | P1 | P12 | P11 | P10 | GND | VTG | VTG | TRST | TDI | TMS | TCK | GND | I/O | JTAG | RTCK | TDO | TSRST | DBGRQ | Dangerous Prototypes | DBGACK | Bus Blaster v4.0 | CC-BY-SA | P61 | P64 | P67 | P68 | P70 | P71 | P72 | P74 | P89 | P90 | P99 | GND | VTG
bNames: Bus Blaster v4.0 | Dangerous Prototypes | CC-BY-SA | Fufillment By: | Seeed Studio | www.seeedstudio.com